# EAGLE design rx_mod-2 (EAGLE 7.2.0)
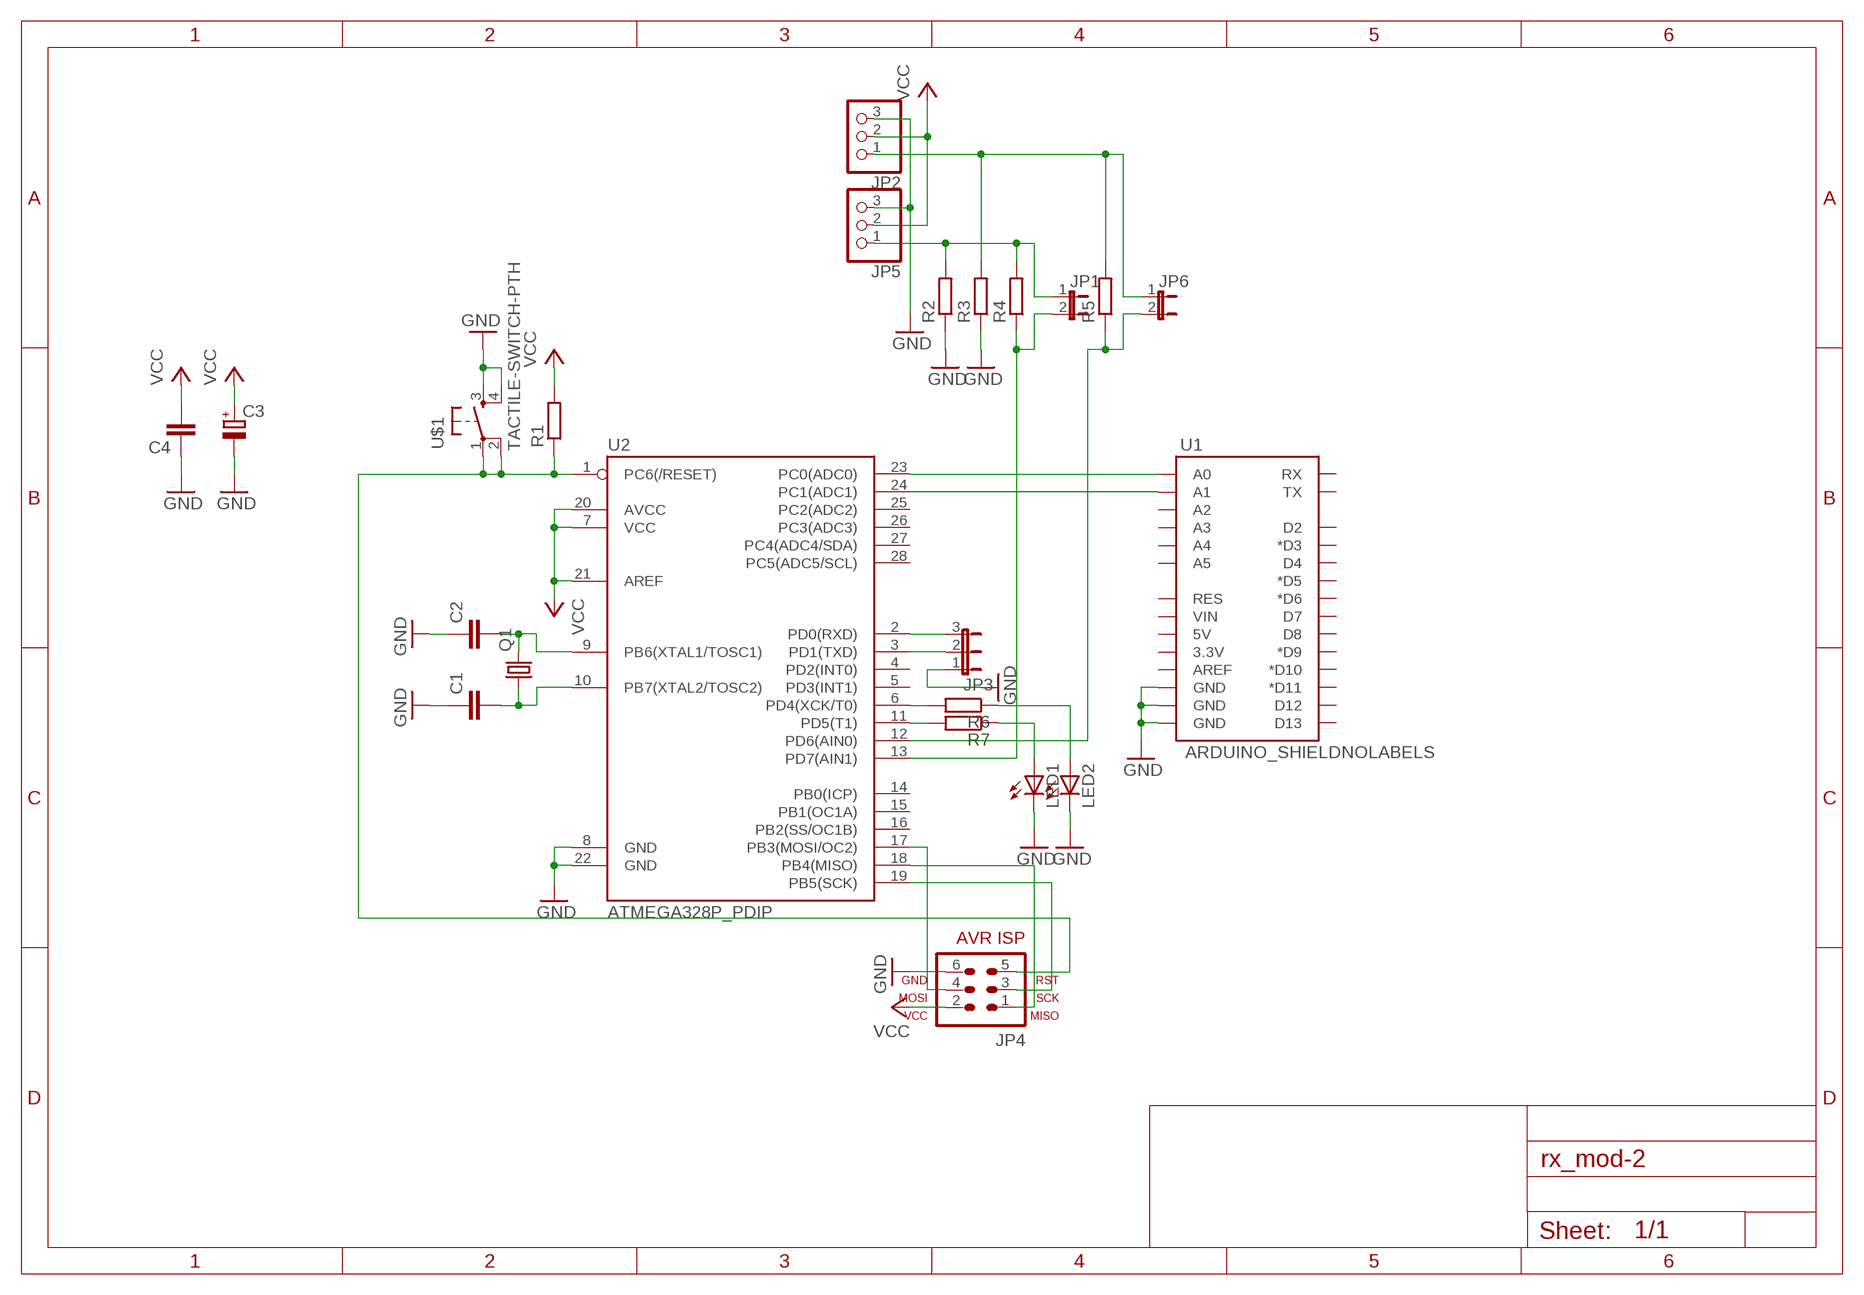
[diagram p0: schematic, sheet 1]

## Parts
C1  C-EU050-030X075  [C050-030X075]
C2  C-EU050-030X075  [C050-030X075]
C3  CPOL-EUE2.5-6  [E2,5-6]
C4  C-EU050-030X075  [C050-030X075]
JP1  JP1E  [JP1]
JP2  PINHD-1X3/90  [1X03/90]
JP3  JP2E  [JP2]
JP4  AVR-ISP-6VERT  [AVR-ISP-6]
JP5  PINHD-1X3/90  [1X03/90]
JP6  JP1E  [JP1]
LED1  LED5MM  [LED5MM]
LED2  LED5MM  [LED5MM]
Q1  CRYSTALHC49U70  [HC49U70]
R1  R-EU_0207/10  [0207/10]
R2  R-EU_0207/10  [0207/10]
R3  R-EU_0207/10  [0207/10]
R4  R-EU_0207/10  [0207/10]
R5  R-EU_0207/10  [0207/10]
R6  R-EU_0207/10  [0207/10]
R7  R-EU_0207/10  [0207/10]
U1  ARDUINO_SHIELDNOLABELS  [DUEMILANOVE_SHIELD_NOLABELS]
U2  ATMEGA328P_PDIP  [DIL28-3]
U$1  TACTILE-SWITCH-PTH  [TAC-SWITCH-PTH]

## Nets
GND: C1.1 C2.1 C3.- C4.1 JP2.3 JP3.1 JP4.6 JP5.3 LED1.K(C) LED2.K(C) R2.1 R3.1 U1.GND@0(GND) U1.GND@1(GND) U1.GND@2(GND) U2.8(GND) U2.22(GND) U$1.3 U$1.4
N$1: JP6.2 R5.1 U2.12(PD6(AIN0))
N$2: JP1.2 R4.1 U2.13(PD7(AIN1))
N$3: JP1.1 JP5.1 R2.2 R4.2
N$4: JP2.1 JP6.1 R3.2 R5.2
N$5: JP4.5 R1.1 U2.1(PC6(/RESET)) U$1.1 U$1.2
N$6: JP3.2 U2.3(PD1(TXD))
N$7: JP3.3 U2.2(PD0(RXD))
N$8: C2.2 Q1.2 U2.9(PB6(XTAL1/TOSC1))
N$9: C1.2 Q1.1 U2.10(PB7(XTAL2/TOSC2))
N$10: JP4.4 U2.17(PB3(MOSI/OC2))
N$11: JP4.1 U2.18(PB4(MISO))
N$12: JP4.3 U2.19(PB5(SCK))
N$13: R7.2 U2.11(PD5(T1))
N$14: R6.2 U2.6(PD4(XCK/T0))
N$15: LED2.A R6.1
N$16: LED1.A R7.1
N$17: U1.A0 U2.23(PC0(ADC0))
N$18: U1.A1 U2.24(PC1(ADC1))
VCC: C3.+ C4.2 JP2.2 JP4.2 JP5.2 R1.2 U2.7(VCC) U2.20(AVCC) U2.21(AREF)
Unconnected: U1.3.3V U1.5V U1.A2 U1.A3 U1.A4 U1.A5 U1.AREF U1.D2 U1.D3(*D3) U1.D4 U1.D5(*D5) U1.D6(*D6) U1.D7 U1.D8 U1.D9(*D9) U1.D10(*D10) U1.D11(*D11) U1.D12 U1.D13 U1.RES U1.RX U1.TX U1.VIN U2.4(PD2(INT0)) U2.5(PD3(INT1)) U2.14(PB0(ICP)) U2.15(PB1(OC1A)) U2.16(PB2(SS/OC1B)) U2.25(PC2(ADC2)) U2.26(PC3(ADC3)) U2.27(PC4(ADC4/SDA)) U2.28(PC5(ADC5/SCL))

## Library data of the parts
C1 C2 C4 = resistor:C-EU: CAPACITOR, European symbol
C3 = resistor:CPOL-EU: POLARIZED CAPACITOR, European symbol
JP1 JP6 = jumper:JP1E: JUMPER
JP2 JP5 = pinhead:PINHD-1X3: PIN HEADER
JP3 = jumper:JP2E: JUMPER
JP4 = avr-7:AVR-ISP-6: AVR ISP-6 Serial Programming Header
LED1 LED2 = led:LED: LED OSRAM: - CHIPLED LG R971, LG N971, LY N971, LG Q971, LY Q971, LO R971, LY R971 LH N974, LH R974 LS Q976, LO Q976, LY Q976 LO Q996 - Hyper CHIPLED LW Q18S LB Q993, LB Q99A, LB R99A - SideLED LS A670, LO A670, LY A670, LG A670, LP A670 LB A673, LV A673, LT A673, LW A673 LH A674 LY A675 LS A676, LA A676, LO A676, LY A676, LW A676 LS A679, LY A679, LG A679 - Hyper Micro SIDELED® LS Y876, LA Y876, LO Y876, LY Y876 LT Y87S - SmartLED LW L88C, LW L88S LB L89C, LB L89S, LG L890 LS L89K, LO L89K, LY L89K LS L896, LA L896, LO L896, LY L896 - TOPLED LS T670, LO T670, LY T670, LG T670, LP T670 LSG T670, LSP T670, LSY T670, LOP T670, LYG T670 LG T671, LOG T671, LSG T671 LB T673, LV T673, LT T673, LW T673 LH T674 LS T676, LA T676, LO T676, LY T676, LB T676, LH T676, LSB T676, LW T676 LB T67C, LV T67C, LT T67C, LS T67K, LO T67K, LY T67K, LW E67C LS E67B, LA E67B, LO E67B, LY E67B, LB E67C, LV E67C, LT E67C LW T67C LS T679, LY T679, LG T679 LS T770, LO T770, LY T770, LG T770, LP T770 LB T773, LV T773, LT T773, LW T773 LH T774 LS E675, LA E675, LY E675, LS T675 LS T776, LA T776, LO T776, LY T776, LB T776 LHGB T686 LT T68C, LB T68C - Hyper Mini TOPLED® LB M676 - Mini TOPLED Santana® LG M470 LS M47K, LO M47K, LY M47K Source: http://www.osram.convergy.de LUXEON: - LUMILED® LXK2-PW12-R00, LXK2-PW12-S00, LXK2-PW14-U00, LXK2-PW14-V00 LXK2-PM12-R00, LXK2-PM12-S00, LXK2-PM14-U00 LXK2-PE12-Q00, LXK2-PE12-R00, LXK2-PE12-S00, LXK2-PE14-T00, LXK2-PE14-U00 LXK2-PB12-K00, LXK2-PB12-L00, LXK2-PB12-M00, LXK2-PB14-N00, LXK2-PB14-P00, LXK2-PB14-Q00 LXK2-PR12-L00, LXK2-PR12-M00, LXK2-PR14-Q00, LXK2-PR14-R00 LXK2-PD12-Q00, LXK2-PD12-R00, LXK2-PD12-S00 LXK2-PH12-R00, LXK2-PH12-S00 LXK2-PL12-P00, LXK2-PL12-Q00, LXK2-PL12-R00 Source: www.luxeon.com KINGBRIGHT: KA-3528ASYC Source: www.kingbright.com
Q1 = crystal:CRYSTAL: CRYSTAL; OC_FARNELL: unknown; OC_NEWARK: unknown
R1-R7 = resistor:R-EU_: RESISTOR, European symbol
U1 = SparkFun-Boards:ARDUINO_SHIELD: Arduino shield footprint
U2 = SparkFun-DigitalIC:ATMEGA328P_PDIP: uC used in the Arduino 32kb flash, 1k EEPROM, 2k SRAM This is the through-hole version of this chip.
U$1 = GeekAmmo:TACTILE-SWITCH: Tactile Switch 4 Pins, SPST NO

## Board
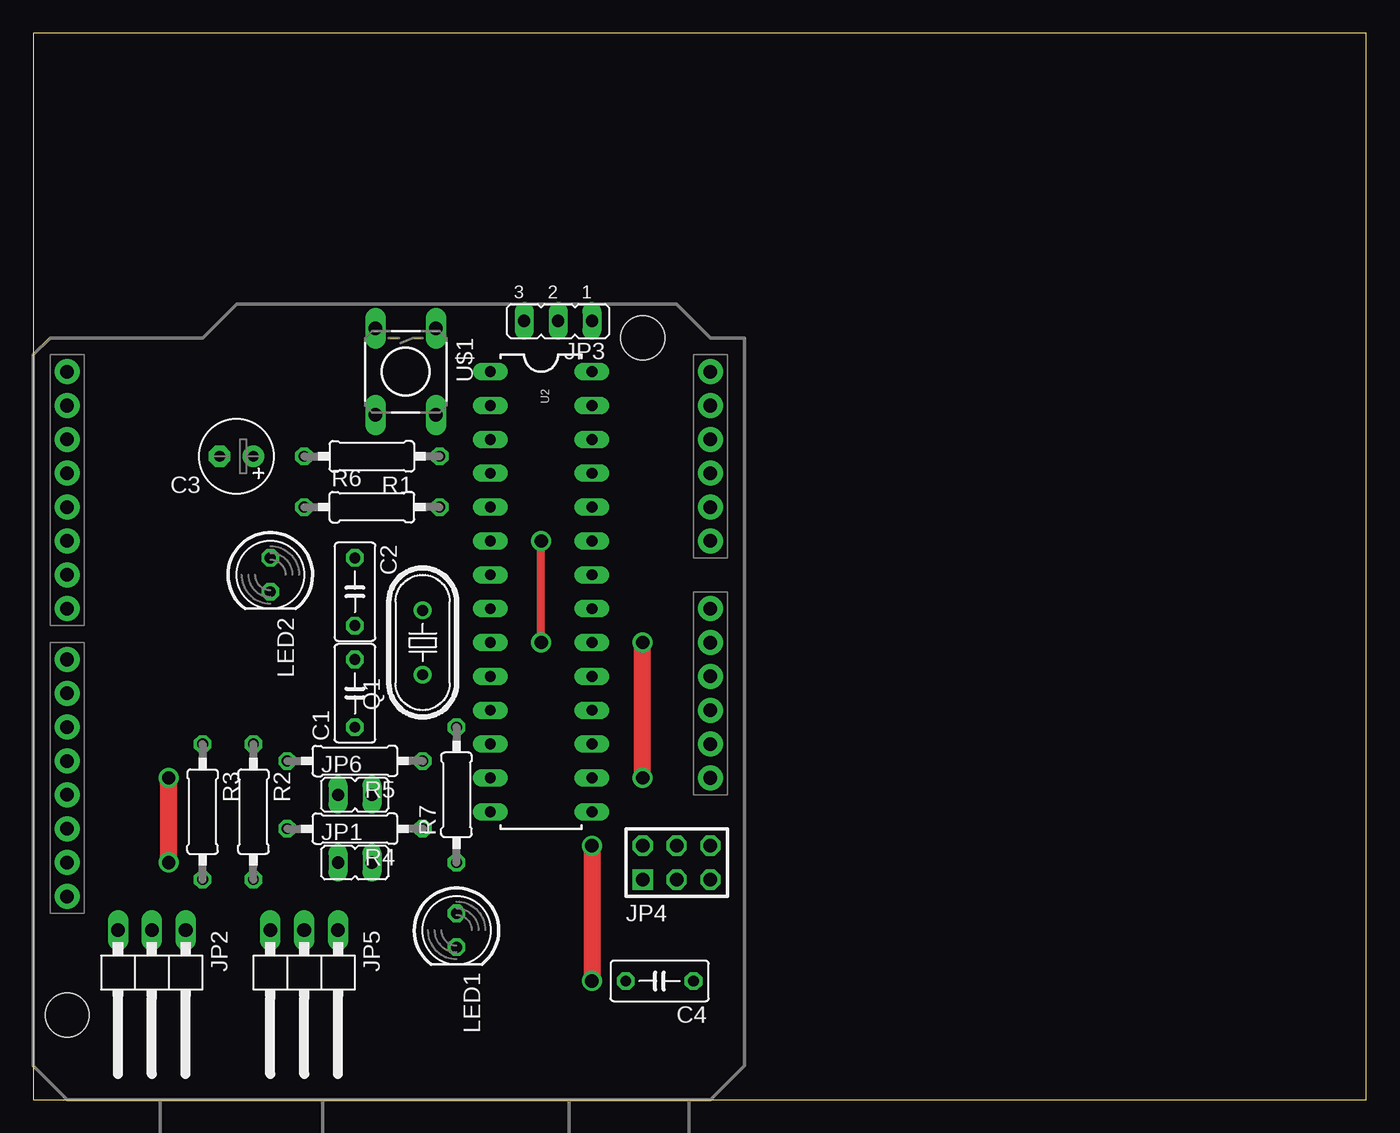
[diagram p1: board, top side]
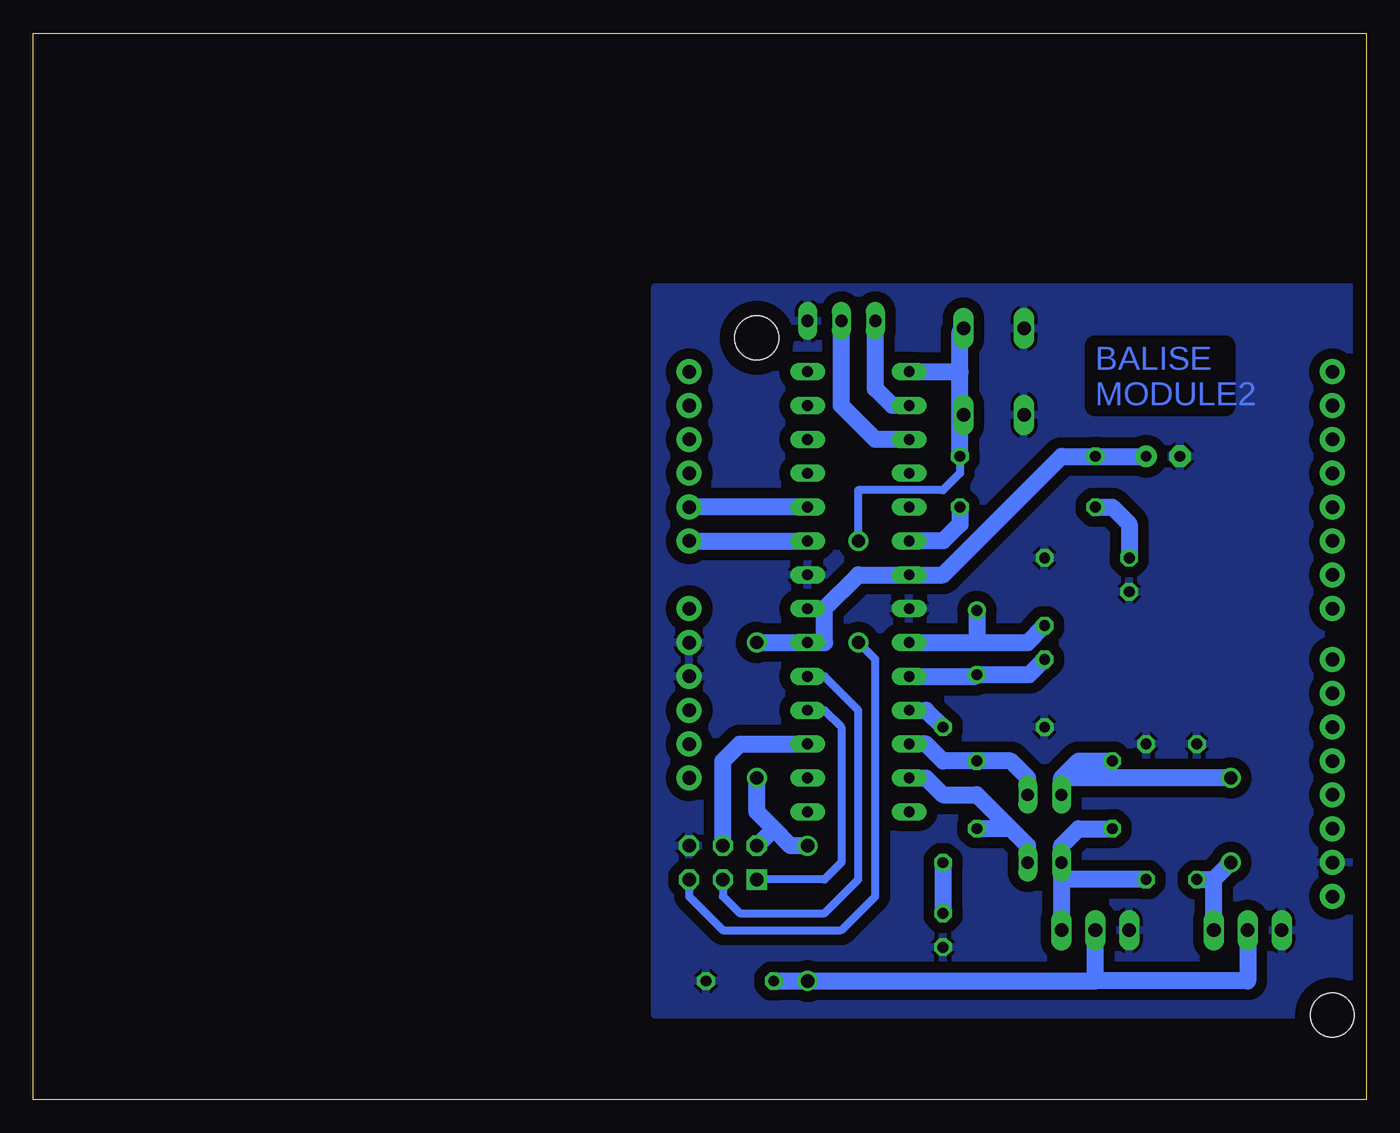
[diagram p2: board, bottom side, seen from below]

Size 100 x 80 mm. Coordinates in mm from the lower left corner, seen from the top.
Outline: 0,0 100,0 100,80 0,80 0,0
Copper layers (1*16): Top 0.035mm / dielectric 1.5mm / Bottom 0.035mm
Design rules "default": minimum track width 10mil, minimum drill 24mil, track to track 8mil, track to pad 8mil, pad to pad 8mil, via to via 8mil, smd to smd 8mil, copper to edge 40mil, drill to drill 8mil, minimum pad ring 10mil, minimum via ring 8mil, stop-mask expansion 4mil, vias tented up to drill 0mil, thermal gap 10mil

### Footprints (pad centres in the part's own frame; a part is rotated, then mirrored left to right if it is on the bottom)
C050-030X075 = drill 0.813 octagon: 1 -2.54,0; 2 2.54,0
E2,5-6 = drill 0.813 pad 1.6: + -1.27,0 | drill 0.813 pad 1.6 octagon: - 1.27,0
JP1 = drill 0.914 long: 1 0,-1.27; 2 0,1.27
1X03/90 = drill 1.016 long: 1 -2.54,-3.81; 2 0,-3.81; 3 2.54,-3.81
JP2 = drill 0.914 long: 1 -2.54,0; 2 0,0; 3 2.54,0
AVR-ISP-6 = drill 1.016 square: 1 -2.54,-1.27 | drill 1.016 octagon: 2 -2.54,1.27; 3 0,-1.27; 4 0,1.27; 5 2.54,-1.27; 6 2.54,1.27
LED5MM = drill 0.813 octagon: A -1.27,0; K 1.27,0
HC49U70 = drill 0.813: 1 -2.413,0; 2 2.413,0
0207/10 = drill 0.813 octagon: 1 -5.08,0; 2 5.08,0
DUEMILANOVE_SHIELD_NOLABELS = drill 1.016 pad 1.88: 3.3V 50.8,26.67; 5V 50.8,29.21; A0 50.8,41.91; A1 50.8,44.45; A2 50.8,46.99; A3 50.8,49.53; A4 50.8,52.07; A5 50.8,54.61; AREF 2.54,15.24; D2 2.54,49.53; D3 2.54,46.99; D4 2.54,44.45; D5 2.54,41.91; D6 2.54,39.37; D7 2.54,36.83; D8 2.54,33.02; D9 2.54,30.48; D10 2.54,27.94; D11 2.54,25.4; D12 2.54,22.86; D13 2.54,20.32; GND@0 50.8,31.75; GND@1 50.8,34.29; GND@2 2.54,17.78; RES 50.8,24.13; RX 2.54,54.61; TX 2.54,52.07; VIN 50.8,36.83 | hole 3.302: 45.72,57.15; 2.54,6.35
DIL28-3 = drill 0.813 long: 1 -16.51,-3.81; 2 -13.97,-3.81; 3 -11.43,-3.81; 4 -8.89,-3.81; 5 -6.35,-3.81; 6 -3.81,-3.81; 7 -1.27,-3.81; 8 1.27,-3.81; 9 3.81,-3.81; 10 6.35,-3.81; 11 8.89,-3.81; 12 11.43,-3.81; 13 13.97,-3.81; 14 16.51,-3.81; 15 16.51,3.81; 16 13.97,3.81; 17 11.43,3.81; 18 8.89,3.81; 19 6.35,3.81; 20 3.81,3.81; 21 1.27,3.81; 22 -1.27,3.81; 23 -3.81,3.81; 24 -6.35,3.81; 25 -8.89,3.81; 26 -11.43,3.81; 27 -13.97,3.81; 28 -16.51,3.81
TAC-SWITCH-PTH = drill 1.016 pad 1.524 long: 1 -3.251,2.261; 2 3.251,2.261; 3 -3.251,-2.261; 4 3.251,-2.261

### Placement (x,y rotation side)
C1  24.13,30.48 90 top
C2  24.13,38.1 270 top
C3  15.24,48.26 180 top
C4  46.99,8.89 180 top
JP1  24.13,17.78 270 top
JP2  8.89,8.89 180 top
JP3  39.37,58.42 180 top
JP4  48.26,17.78 0 top
JP5  20.32,8.89 180 top
JP6  24.13,22.86 270 top
LED1  31.75,12.7 270 top
LED2  17.78,39.37 270 top
Q1  29.21,34.29 90 top
R1  25.4,48.26 180 top
R2  16.51,21.59 270 top
R3  12.7,21.59 270 top
R4  24.13,20.32 180 top
R5  24.13,25.4 180 top
R6  25.4,44.45 0 top
R7  31.75,22.86 90 top
U1  0,0 0 top
U2  38.1,38.1 270 top
U$1  27.94,54.61 270 top

### Tracks (layer width: path | path; a pad name or v marks a point on that pad's centre or on a via)
GND
  pour Bottom (isolate 0.8): 0,6.35 53.34,6.35 53.34,60.96 0,60.96
N$1
  Bottom 1.27: JP6.2 25.4,24.13 26.67,25.4 R5.1 31.75,25.4 33.02,26.67 U2.12
N$2
  Bottom 1.27: JP1.2 25.4,19.05 26.67,20.32 | 26.67,20.32 R4.1 | U2.13 33.02,24.13 31.75,22.86 29.21,22.86 26.67,20.32
N$3
  Bottom 1.27: R4.2 21.59,20.32 22.86,19.05 JP1.1 22.86,16.51 | 22.86,16.51 JP5.1 | R2.2 22.86,16.51
N$4  (via drill 1)
  Top 1.27: v10.16,17.78 v10.16,24.13
  Bottom 1.27: JP6.1 22.86,24.13 | 22.86,24.13 21.59,25.4 R5.2 | JP2.1 11.43,16.51 | v10.16,24.13 22.86,24.13 | R3.2 11.43,16.51 | 11.43,16.51 v10.16,17.78
N$5  (via drill 1)
  Top 0.61: v38.1,34.29 v38.1,41.91
  Bottom 0.61: JP4.5 50.8,15.24 48.26,12.7 39.37,12.7 36.83,15.24 36.83,33.02 v38.1,34.29 | v38.1,41.91 38.1,45.72 31.75,45.72 30.48,46.99 R1.1
  Bottom 1.27: U2.1 30.48,54.61 | 30.48,54.61 30.48,57.58 U$1.1 | U$1.2 30.48,51.64 | 30.48,51.64 30.48,54.61 | R1.1 30.48,51.64
N$6
  Bottom 1.27: U2.3 36.83,49.53 39.37,52.07 JP3.2
N$7
  Bottom 1.27: U2.2 35.56,52.07 36.83,53.34 JP3.3
N$8
  Bottom 1.27: U2.9 29.21,34.29 | 29.21,34.29 25.4,34.29 C2.2 | Q1.2 29.21,34.29
N$9
  Bottom 1.27: U2.10 29.34,31.75 Q1.1 25.27,31.88 C1.2
N$10
  Bottom 1.27: JP4.4 48.26,25.4 46.99,26.67 U2.17
N$11
  Bottom 0.61: U2.18 40.64,29.21 39.37,27.94 39.37,17.78 40.64,16.51 JP4.1
N$12
  Bottom 0.61: JP4.3 48.26,15.24 46.99,13.97 40.64,13.97 38.1,16.51 38.1,29.21 40.64,31.75 U2.19
N$13
  Bottom 1.27: U2.11 33.02,29.21 R7.2
N$14
  Bottom 1.27: R6.2 30.48,43.18 31.75,41.91 U2.6
N$15
  Bottom 1.27: R6.1 19.05,44.45 17.78,43.18 LED2.A
N$16
  Bottom 1.27: R7.1 LED1.A
N$17
  Bottom 1.27: U1.A0 U2.23
N$18
  Bottom 1.27: U2.24 U1.A1
VCC  (via drill 1)
  Top 1.27: v45.72,24.13 v45.72,34.29 | v41.91,19.05 v41.91,8.89
  Bottom 1.27: U2.21 40.64,36.83 | 40.64,36.83 38.1,39.37 U2.7 31.75,39.37 22.86,48.26 R1.2 C3.+ | 40.64,36.83 40.64,34.29 U2.20 v45.72,34.29 | JP2.2 8.89,8.89 20.32,8.89 | 20.32,8.89 JP5.2 | 20.32,8.89 v41.91,8.89 C4.2 | v41.91,19.05 43.18,19.05 44.45,20.32 | 44.45,20.32 45.72,21.59 v45.72,24.13 | JP4.2 44.45,20.32

### Text on the board
Bottom: BALISE / MODULE2